# Altium schematic sheet Level Shifter.SchDoc
size A4; SheetNumber: 6; SheetTotal: 6
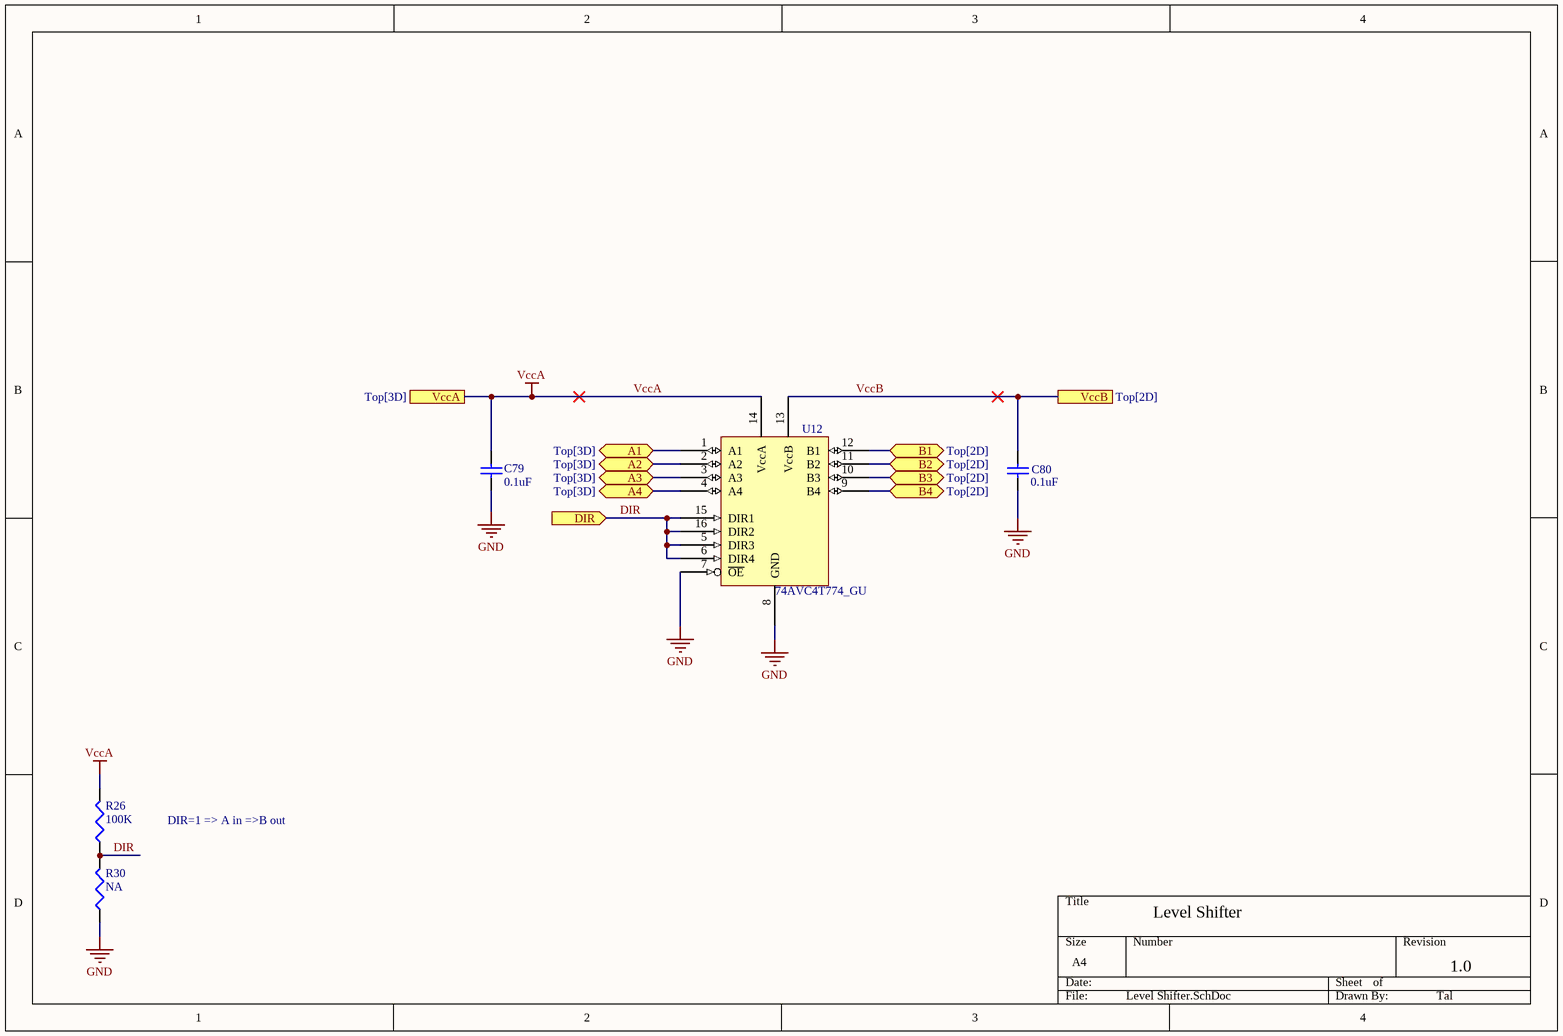
[diagram p0: Level Shifter.SchDoc]

## Parts
C79  Capacitance: 0.1uF  [C0402]  (hidden comment: 0.1uF 50V)
C80  Capacitance: 0.1uF  [C0402]  (hidden comment: 0.1uF 50V)
R26  100K  [R0402]
R30  NA  [R0402]
U12  74AVC4T774_GU  [NXP_74AVC4T245GU,115]

## Ports
A1 (bidir, see Top[3D]), A2 (bidir, see Top[3D]), A3 (bidir, see Top[3D]), A4 (bidir, see Top[3D]), B1 (bidir, see Top[2D]), B2 (bidir, see Top[2D]), B3 (bidir, see Top[2D]), B4 (bidir, see Top[2D]), DIR (in), VccA (see Top[3D]), VccB (see Top[2D])

## Nets
GND: C79.1 C80.1 R30.1 U12.7(~{OE}) U12.8(GND)
VccA: C79.2 R26.2 U12.14(VccA) ; port VccA
A1: U12.1(A1) ; port A1
A2: U12.2(A2) ; port A2
A3: U12.3(A3) ; port A3
A4: U12.4(A4) ; port A4
B1: U12.12(B1) ; port B1
B2: U12.11(B2) ; port B2
B3: U12.10(B3) ; port B3
B4: U12.9(B4) ; port B4
DIR: R26.1 R30.2 U12.5(DIR3) U12.6(DIR4) U12.15(DIR1) U12.16(DIR2) ; port DIR
VccB: C80.2 U12.13(VccB) ; port VccB

## Notes on the sheet
- DIR=1 => A in =>B out
- Level Shifter
- 1.0
- Tal

## Library data of the parts
C79 C80 = CAP CER 6.8pF 50V NP0 0402: CAP CER 0.1uF 50V NP0 0402; Manufacturer Part Number: C1005C0G1H6R8D; Manufacturer: TDK Corporation; LANDA P/N: ECP-000033; RoHS: RoHS Compliant; Package / Case: 0402 (1005 Metric); ComponentLink1URL: http://www.tdk.com/pdf/general_B11.pdf; ComponentLink1Description: http://www.tdk.com/pdf/general_B11.pdf; Voltage - Rated: 50V
R26 = RES 3.09K OHM 1/16W 1% 0402: RES 100K OHM 1/16W 1% 0402; Manufacturer Part Number: RMCF0402FT3K09; Manufacturer: Stackpole Electronics Inc; Power (Watts): 0.063W, 1/16W; LANDA P/N: ERS-000063; Supplier Device Package: 0402; Package / Case: 0402 (1005 Metric); RoHS: RoHS Compliant; ComponentLink1URL: http://www.seielect.com/Catalog/SEI-RMCF_RMCP.pdf; ComponentLink1Description: http://www.seielect.com/Catalog/SEI-RMCF_RMCP.pdf
R30 = RES 3.09K OHM 1/16W 1% 0402: Manufacturer Part Number: RMCF0402FT3K09; Manufacturer: Stackpole Electronics Inc; Power (Watts): 0.063W, 1/16W; LANDA P/N: ERS-000063; Supplier Device Package: 0402; Package / Case: 0402 (1005 Metric); RoHS: RoHS Compliant; ComponentLink1URL: http://www.seielect.com/Catalog/SEI-RMCF_RMCP.pdf; ComponentLink1Description: http://www.seielect.com/Catalog/SEI-RMCF_RMCP.pdf